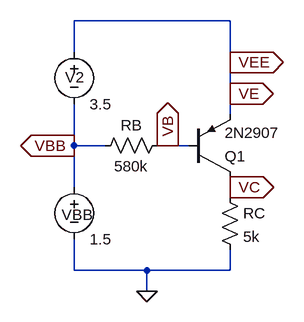
[diagram p0: schematic exam5_04a.asc]
exam5_04a.asc, the LTspice schematic file:
Version 4
SHEET 1 880 680
WIRE 272 0 32 0
WIRE 32 48 32 0
WIRE 272 64 272 0
WIRE 272 112 272 64
WIRE 272 144 272 112
WIRE 32 192 32 128
WIRE 80 192 32 192
WIRE 176 192 160 192
WIRE 208 192 176 192
WIRE 32 256 32 192
WIRE 272 256 272 240
WIRE 272 272 272 256
WIRE 32 384 32 336
WIRE 144 384 32 384
WIRE 272 384 272 352
WIRE 272 384 144 384
WIRE 144 416 144 384
FLAG 144 416 0
FLAG 32 192 VBB
IOPIN 32 192 Out
FLAG 272 64 VEE
IOPIN 272 64 Out
FLAG 272 112 VE
IOPIN 272 112 Out
FLAG 272 256 VC
IOPIN 272 256 Out
FLAG 176 192 VB
IOPIN 176 192 Out
SYMBOL pnp 208 240 M180
SYMATTR InstName Q1
SYMATTR Value 2N2907
SYMBOL res 256 256 R0
SYMATTR InstName RC
SYMATTR Value 5k
SYMBOL res 176 176 R90
WINDOW 0 0 56 VBottom 2
WINDOW 3 32 56 VTop 2
SYMATTR InstName RB
SYMATTR Value 580k
SYMBOL voltage 32 240 R0
WINDOW 0 -19 58 Left 2
SYMATTR InstName VBB
SYMATTR Value 1.5
SYMBOL voltage 32 32 R0
WINDOW 0 -14 55 Left 2
SYMATTR InstName V2
SYMATTR Value 3.5

The netlist it stands for:
* exam5_04a.asc
Q1 VC VB VE 0 2N2907
RC VC 0 5k
RB VB VBB 580k
VBB VBB 0 1.5
V2 VE VBB 3.5
.model NPN NPN
.model PNP PNP
.lib standard.bjt
.backanno
.end